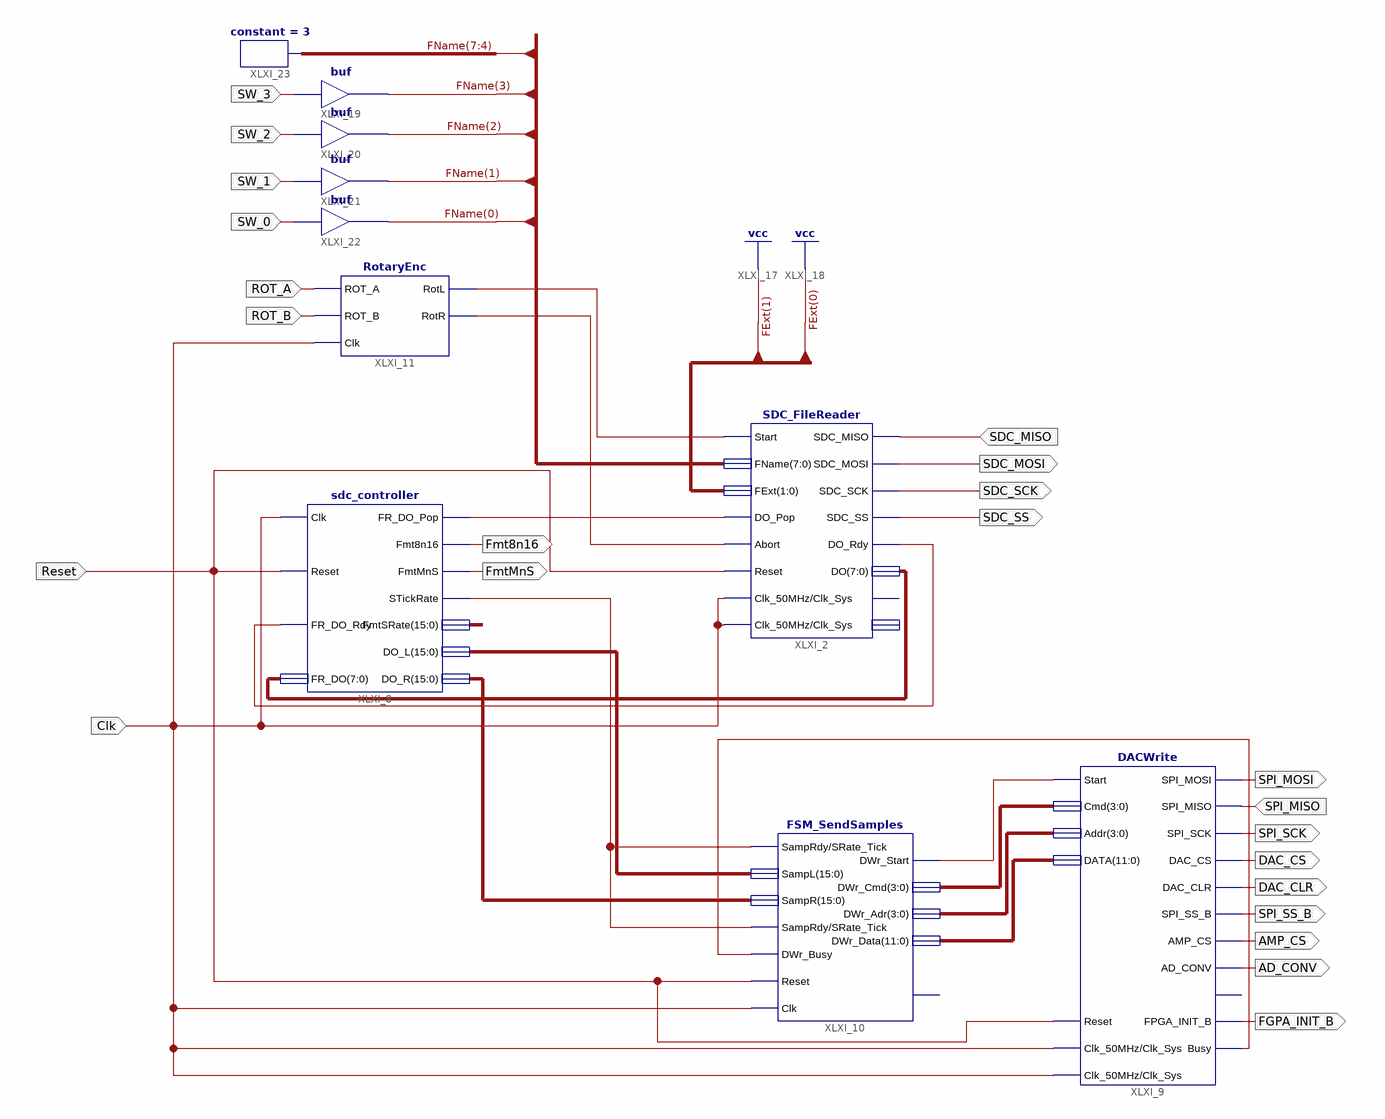
[diagram p0: schematic sheet 1]
// Xilinx ISE schematic schemat_new.sch (artix7) as structural Verilog: 10 symbols, 23 ports
module schemat_new (
  input  SDC_MISO,
  input  Clk,
  input  Reset,
  input  SW_3,
  input  SW_2,
  input  SW_1,
  input  SW_0,
  input  ROT_A,
  input  ROT_B,
  input  SPI_MISO,
  output SDC_MOSI,
  output SDC_SCK,
  output SDC_SS,
  output Fmt8n16,
  output FmtMnS,
  output SPI_MOSI,
  output SPI_SCK,
  output DAC_CS,
  output DAC_CLR,
  output SPI_SS_B,
  output AMP_CS,
  output AD_CONV,
  output FGPA_INIT_B
);

  wire XLXN_5, XLXN_30, XLXN_31, XLXN_49, XLXN_54, XLXN_56, XLXN_68;
  wire [3:0] XLXN_50, XLXN_51;
  wire [7:0] FName, XLXN_9;
  wire [11:0] XLXN_52;
  wire [15:0] DO_L, DO_R, FmtSRate;

  SDC_FileReader XLXI_2 (
    .SDC_MISO(SDC_MISO), .Start(XLXN_30), .FName(FName), .Reset(Reset), .Clk_50MHz(Clk), .DO_Pop(XLXN_5),
    .Abort(XLXN_31), .SDC_MOSI(SDC_MOSI), .SDC_SCK(SDC_SCK), .SDC_SS(SDC_SS), .DO(XLXN_9), .DO_Rdy(XLXN_68),
    .FExt(2'b11), .Clk_Sys(Clk));  // open: Error, Busy
  sdc_controller XLXI_8 (
    .Clk(Clk), .Reset(Reset), .FR_DO_Rdy(XLXN_68), .FR_DO(XLXN_9), .FR_DO_Pop(XLXN_5), .Fmt8n16(Fmt8n16),
    .FmtMnS(FmtMnS), .STickRate(XLXN_54), .FmtSRate(FmtSRate), .DO_L(DO_L), .DO_R(DO_R));
  DACWrite XLXI_9 (
    .Reset(Reset), .Start(XLXN_49), .SPI_MISO(SPI_MISO), .Cmd(XLXN_50), .Addr(XLXN_51), .DATA(XLXN_52),
    .DAC_CLR(DAC_CLR), .DAC_CS(DAC_CS), .SPI_MOSI(SPI_MOSI), .SPI_SCK(SPI_SCK), .SPI_SS_B(SPI_SS_B),
    .AMP_CS(AMP_CS), .AD_CONV(AD_CONV), .FPGA_INIT_B(FGPA_INIT_B), .Busy(XLXN_56), .Clk_50MHz(Clk),
    .Clk_Sys(Clk));  // open: SF_CE0
  FSM_SendSamples XLXI_10 (
    .DWr_Busy(XLXN_56), .SampRdy(XLXN_54), .SampL(DO_L), .SampR(DO_R), .SRate_Tick(XLXN_54), .Reset(Reset),
    .Clk(Clk), .DWr_Start(XLXN_49), .DWr_Cmd(XLXN_50), .DWr_Adr(XLXN_51), .DWr_Data(XLXN_52));  // open: Samp_Pop
  RotaryEnc XLXI_11 (.ROT_A(ROT_A), .ROT_B(ROT_B), .RotL(XLXN_30), .RotR(XLXN_31), .Clk(Clk));
  buf XLXI_19 (FName[3], SW_3);
  buf XLXI_20 (FName[2], SW_2);
  buf XLXI_21 (FName[1], SW_1);
  buf XLXI_22 (FName[0], SW_0);
  constant #(.CValue("3")) XLXI_23 (.O(FName[7:4]));
endmodule
